# EAGLE design Solar Charge Controller (EAGLE 9.6.2)
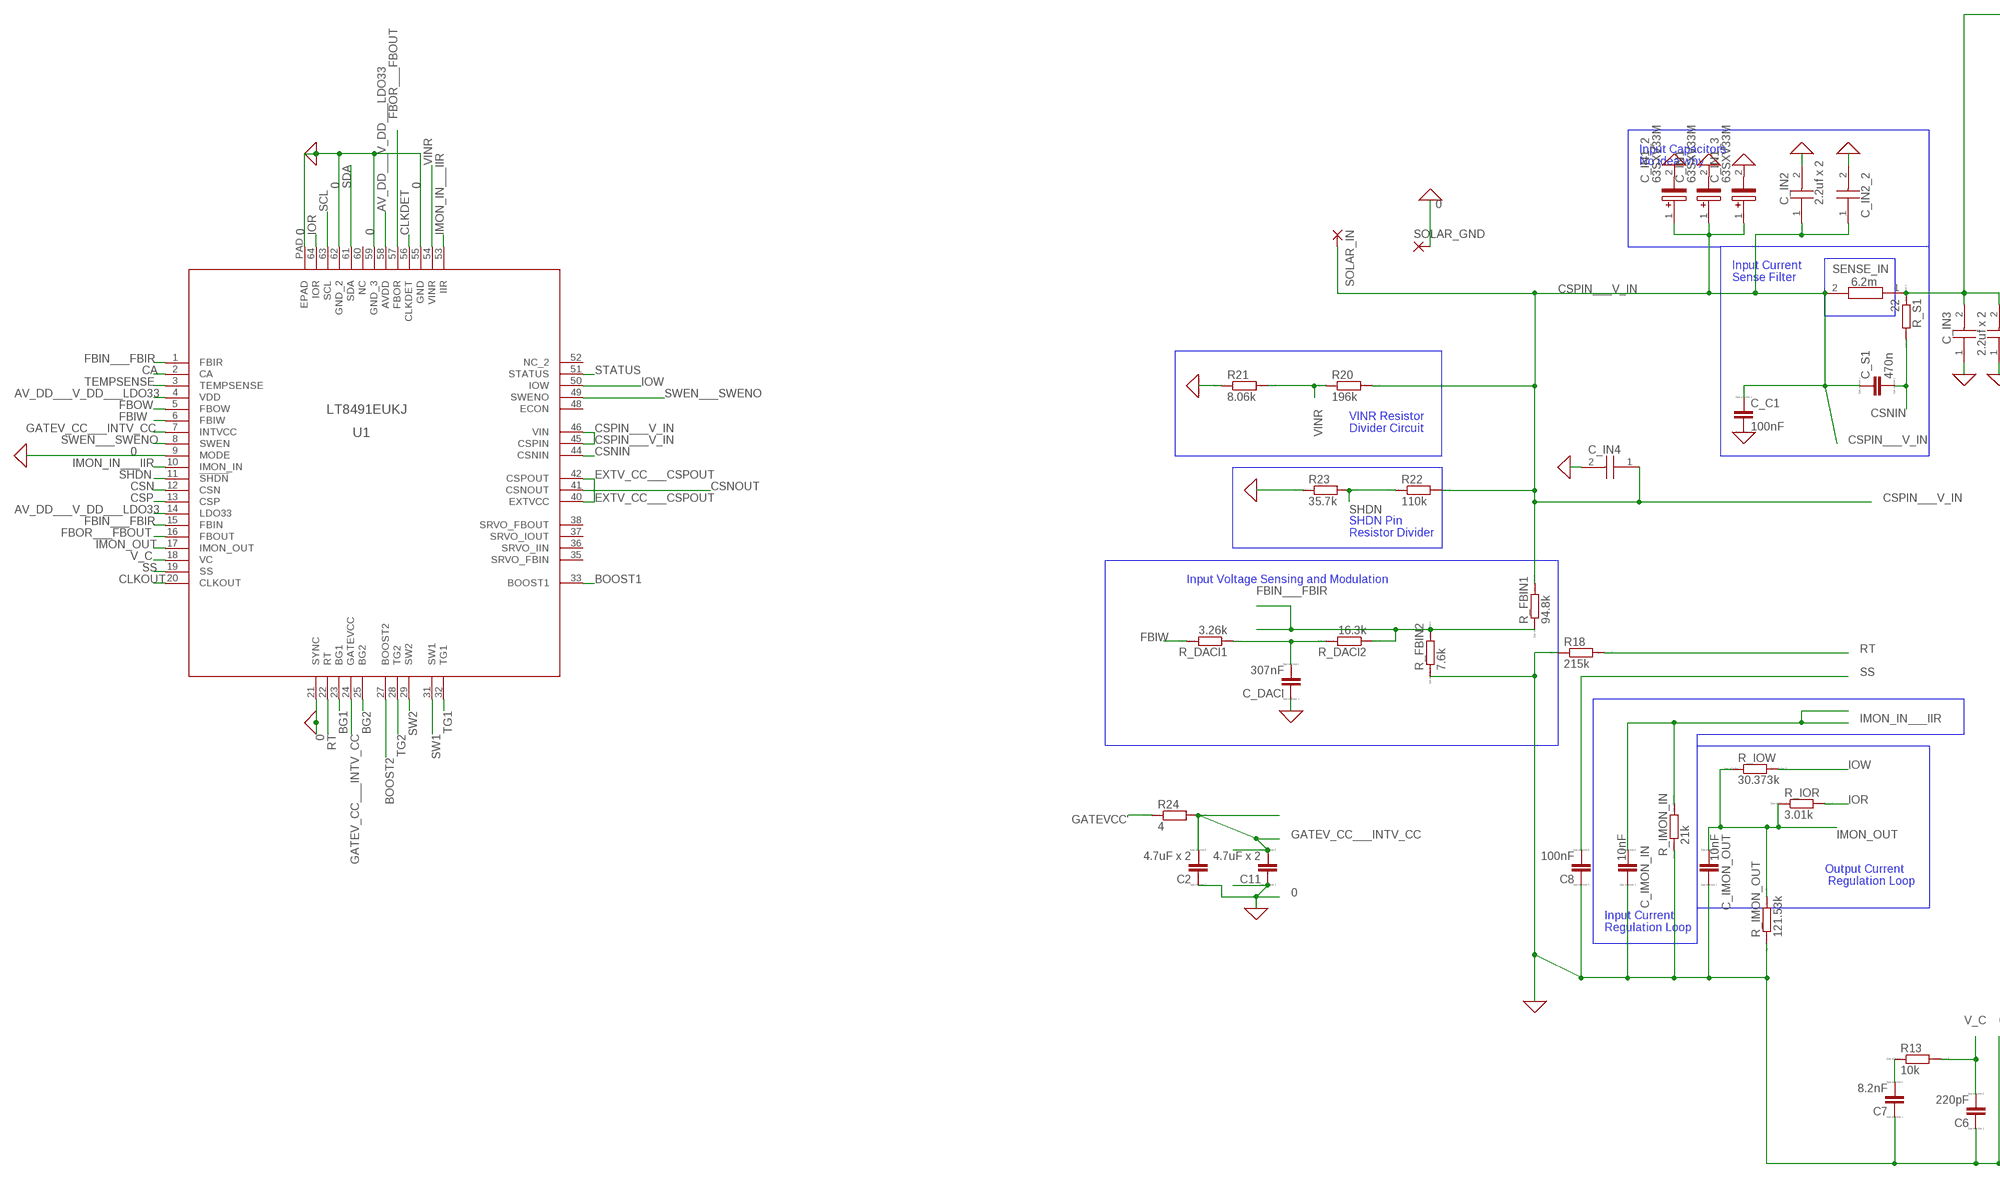
[diagram p0: schematic, sheet 1, part 1 of 2]
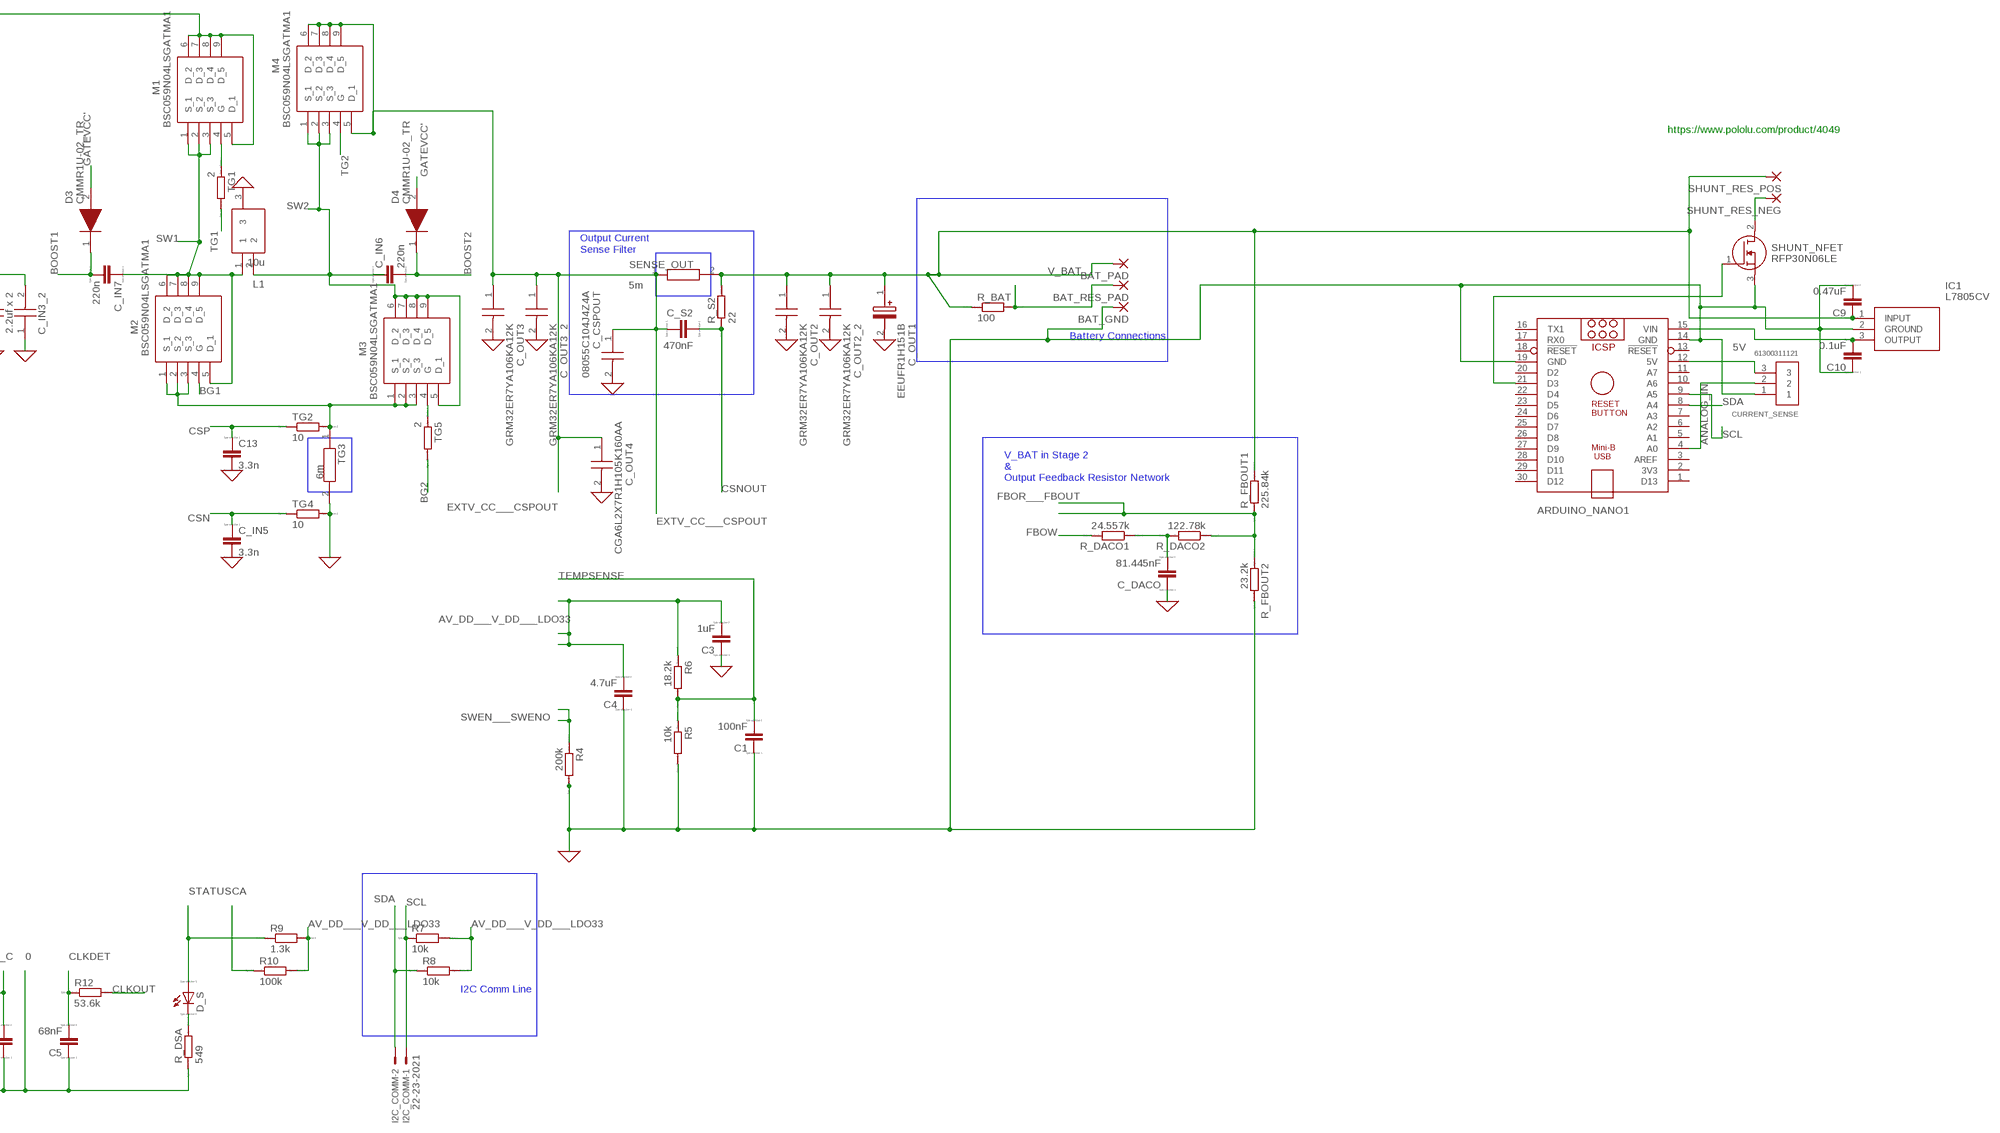
[diagram p1: schematic, sheet 1, part 2 of 2]

## Parts
ARDUINO_NANO1  ARDUINO_NANO  [ARDUINO_NANO]
BAT_GND  SMD5  [SMD2,54-5,08]
BAT_PAD  SMD5  [SMD2,54-5,08]
BAT_RES_PAD  SMD5  [SMD2,54-5,08]
C1  100nF  CC1206  [C1206]
C2  4.7uF x 2  CC1206  [C1206]
C3  1uF  CC1206  [C1206]
C4  4.7uF  CC1206  [C1206]
C5  68nF  CC0603  [C0603]
C6  220pF  CC1206  [C1206]
C7  8.2nF  CC1206  [C1206]
C8  100nF  CC1206  [C1206]
C9  0.47uF  CC1206  [C1206]
C10  0.1uF  CC1206  [C1206]
C11  4.7uF x 2  CC1206  [C1206]
C13  3.3n  CC1206  [C1206]
C_C1  100nF  CC1206  [C1206]
C_CSPOUT  08055C104J4Z4A  [CAPC2012X127N]
C_DACI  307nF  CC1206  [C1206]
C_DACO  81.445nF  CC1206  [C1206]
C_IMON_IN  10nF  CC1206  [C1206]
C_IMON_OUT  10nF  CC1206  [C1206]
C_IN1  63SXV33M  [CAPAE830X1200N]
C_IN1_2  63SXV33M  [CAPAE830X1200N]
C_IN1_3  63SXV33M  [CAPAE830X1200N]
C_IN2  2.2uf x 2  12101C225KAT2A  [CAPC3325X279N]
C_IN2_2  2.2uf x 2  12101C225KAT2A  [CAPC3325X279N]
C_IN3  2.2uf x 2  12101C225KAT2A  [CAPC3325X279N]
C_IN3_2  2.2uf x 2  12101C225KAT2A  [CAPC3325X279N]
C_IN4  2.2uf  12101C225KAT2A  [CAPC3325X279N]
C_IN5  3.3n  CC1206  [C1206]
C_IN6  220n  CC1206  [C1206]
C_IN7  220n  CC1206  [C1206]
C_OUT1  EEUFR1H151B  [CAPPRD500W65D1000H1400]
C_OUT2  GRM32ER7YA106KA12K  [CAPC3225X270N]
C_OUT2_2  GRM32ER7YA106KA12K  [CAPC3225X270N]
C_OUT3  GRM32ER7YA106KA12K  [CAPC3225X270N]
C_OUT3_2  GRM32ER7YA106KA12K  [CAPC3225X270N]
C_OUT4  CGA6L2X7R1H105K160AA  [CAPC3225X280N]
C_S1  470n  CC1206  [C1206]
C_S2  470nF  CC1206  [C1206]
CURRENT_SENSE  61300311121  [61300311121]
D3  CMMR1U-02_TR  [SODFL3818X108N]
D4  CMMR1U-02_TR  [SODFL3818X108N]
D_S  LED_E  [LED_1206]
I2C_COMM  22-23-2021  [22-23-2021]
IC1  L7805CV  [TO255P460X1020X2008-3P]
L1  10u  SER2915H-103KL  [SER2900]
M1  BSC059N04LSGATMA1  [BSC080N03LSG]
M2  BSC059N04LSGATMA1  [BSC080N03LSG]
M3  BSC059N04LSGATMA1  [BSC080N03LSG]
M4  BSC059N04LSGATMA1  [BSC080N03LSG]
R4  200k  RR1206  [R1206]
R5  10k  RR1206  [R1206]
R6  18.2k  RR1206  [R1206]
R7  10k  RR1206  [R1206]
R8  10k  RR1206  [R1206]
R9  1.3k  RR1206  [R1206]
R10  100k  RR1206  [R1206]
R12  53.6k  RR1206  [R1206]
R13  10k  RR1206  [R1206]
R18  215k  RR1206  [R1206]
R20  196k  RR1206  [R1206]
R21  8.06k  RR1206  [R1206]
R22  110k  RR1206  [R1206]
R23  35.7k  RR1206  [R1206]
R24  4  RR1206  [R1206]
R_BAT  100  RR1206  [R1206]
R_DACI1  3.26k  RR1206  [R1206]
R_DACI2  16.3k  RR1206  [R1206]
R_DACO1  24.557k  RR1206  [R1206]
R_DACO2  122.78k  RR1206  [R1206]
R_DSA  549  RR1206  [R1206]
R_FBIN1  94.8k  RR1206  [R1206]
R_FBIN2  7.6k  RR1206  [R1206]
R_FBOUT1  225.84k  RR1206  [R1206]
R_FBOUT2  23.2k  RR1206  [R1206]
R_IMON_IN  21k  RR1206  [R1206]
R_IMON_OUT  121.53k  RR1206  [R1206]
R_IOR  3.01k  RR1206  [R1206]
R_IOW  30.373k  RR1206  [R1206]
R_S1  22  RR1206  [R1206]
R_S2  22  RR1206  [R1206]
SENSE_IN  6.2m  ERJ6LWFR006V  [RESC2012X80N]
SENSE_OUT  5m  ERJ-MP2MF5M0U  [RESC3216X89N]
SHUNT_NFET  RFP30N06LE  [TO254P470X1016X2019-3P]
SHUNT_RES_NEG  SMD5  [SMD2,54-5,08]
SHUNT_RES_POS  SMD5  [SMD2,54-5,08]
SOLAR_GND  SMD5  [SMD2,54-5,08]
SOLAR_IN  SMD5  [SMD2,54-5,08]
TG1  2  RR1206  [R1206]
TG2  10  RR1206  [R1206]
TG3  6m  ERJ6LWFR006V  [RESC2012X80N]
TG4  10  RR1206  [R1206]
TG5  2  RR1206  [R1206]
U1  LT8491EUKJ  [QFN64(58)-UKJ-REV0_ADI]

## Nets
0: ARDUINO_NANO1.14(GND) ARDUINO_NANO1.19(GND) BAT_GND.1(P) C1.1 C2.1 C3.1 C4.1 C5.1 C6.1 C7.1 C8.1 C9.2 C10.1 C11.1 C13.2 C_C1.2 C_CSPOUT.2 C_DACI.1 C_DACO.1 C_IMON_IN.1 C_IMON_OUT.1 C_IN1.2(-) C_IN1_2.2(-) C_IN1_3.2(-) C_IN2.2 C_IN2_2.2 C_IN3.1 C_IN3_2.1 C_IN4.2 C_IN5.2 C_OUT1.2(-) C_OUT2.2 C_OUT2_2.2 C_OUT3.2 C_OUT3_2.2 C_OUT4.2 CURRENT_SENSE.1 IC1.2(GROUND) L1.3 R4.2 R5.2 R18.1 R21.1 R23.1 R_DSA.1 R_FBIN2.1 R_FBOUT2.2 R_IMON_IN.1 R_IMON_OUT.1 SHUNT_NFET.3(S) SOLAR_GND.1(P) TG3.2 TG4.2 U1.9(MODE) U1.21(SYNC) U1.55(GND) U1.59(GND_3) U1.62(GND_2) U1.PAD(EPAD) ; supply symbol labelled GND
5V: ARDUINO_NANO1.12(5V) CURRENT_SENSE.3
ANALOG_IN: ARDUINO_NANO1.4(A0) CURRENT_SENSE.2
AV_DD___V_DD___LDO33: C3.2 C4.2 R6.1 R7.2 R8.2 R9.2 R10.2 U1.4(VDD) U1.14(LDO33) U1.58(AVDD)
BG1: M2.4(G) U1.23(BG1)
BG2: TG5.2 U1.25(BG2)
BOOST1: C_IN7.2 D3.1(K) U1.33(BOOST1)
BOOST2: C_IN6.2 D4.1(K) U1.27(BOOST2)
CA: R10.1 U1.2(CA)
CLKDET: C5.2 R12.1 U1.56(CLKDET)
CLKOUT: R12.2 U1.20(CLKOUT)
CSN: C_IN5.1 TG4.1 U1.12(CSN)
CSNIN: C_S1.2 R_S1.2 U1.44(CSNIN)
CSNOUT: C_S2.2 R_S2.1 U1.41(CSNOUT)
CSP: C13.1 TG2.1 U1.13(CSP)
CSPIN___V_IN: C_C1.1 C_IN1.1(+) C_IN1_2.1(+) C_IN1_3.1(+) C_IN2.1 C_IN2_2.1 C_IN4.1 C_S1.1 R20.2 R22.2 R_FBIN1.2 SENSE_IN.2 SOLAR_IN.1(P) U1.45(CSPIN) U1.46(VIN)
EXTV_CC___CSPOUT: C_CSPOUT.1 C_OUT3.1 C_OUT3_2.1 C_OUT4.1 C_S2.1 M4.5(D_1) M4.6(D_2) M4.7(D_3) M4.8(D_4) M4.9(D_5) SENSE_OUT.1 U1.40(EXTVCC) U1.42(CSPOUT)
FBIN___FBIR: R_DACI2.1 R_FBIN1.1 R_FBIN2.2 U1.1(FBIR) U1.15(FBIN)
FBIW: R_DACI1.2 U1.6(FBIW)
FBOR___FBOUT: R_DACO2.1 R_FBOUT1.1 R_FBOUT2.1 U1.16(FBOUT) U1.57(FBOR)
FBOW: R_DACO1.2 U1.5(FBOW)
GATEV_CC___INTV_CC: C2.2 C11.2 R24.2 U1.7(INTVCC) U1.24(GATEVCC)
GATEVCC': D3.2(A) D4.2(A) R24.1
IMON_IN___IIR: C_IMON_IN.2 R_IMON_IN.2 U1.10(IMON_IN) U1.53(IIR)
IMON_OUT: C_IMON_OUT.2 R_IMON_OUT.2 R_IOR.1 R_IOW.1 U1.17(IMON_OUT)
IOR: R_IOR.2 U1.64(IOR)
IOW: R_IOW.2 U1.50(IOW)
N$1: C_IN3.2 C_IN3_2.2 M1.5(D_1) M1.6(D_2) M1.7(D_3) M1.8(D_4) M1.9(D_5) R_S1.1 SENSE_IN.1
N$2: M2.1(S_1) M2.2(S_2) M2.3(S_3) M3.1(S_1) M3.2(S_2) M3.3(S_3) TG2.2 TG3.1
N$3: M1.4(G) TG1.1
N$4: C_DACI.2 R_DACI1.1 R_DACI2.2
N$5: M3.4(G) TG5.1
N$6: BAT_RES_PAD.1(P) R_BAT.2
N$7: ARDUINO_NANO1.15(VIN) C10.2 IC1.3(OUTPUT)
N$8: SHUNT_NFET.2(D) SHUNT_RES_NEG.1(P)
N$9: ARDUINO_NANO1.21(D3) SHUNT_NFET.1(G)
N$23: C_DACO.2 R_DACO1.1 R_DACO2.2
N$28: D_S.C R_DSA.2
N$32: C7.2 R13.1
RT: R18.2 U1.22(RT)
SCL: ARDUINO_NANO1.9(A5) I2C_COMM.1 R7.1 U1.63(SCL)
SDA: ARDUINO_NANO1.8(A4) I2C_COMM.2 R8.1 U1.61(SDA)
SHDN: R22.1 R23.2 U1.11(!SHDN)
SS: C8.2 U1.19(SS)
STATUS: D_S.A R9.1 U1.51(STATUS)
SW1: C_IN7.1 L1.1 M1.1(S_1) M1.2(S_2) M1.3(S_3) M2.5(D_1) M2.6(D_2) M2.7(D_3) M2.8(D_4) M2.9(D_5) U1.31(SW1)
SW2: C_IN6.1 L1.2 M3.5(D_1) M3.6(D_2) M3.7(D_3) M3.8(D_4) M3.9(D_5) M4.1(S_1) M4.2(S_2) M4.3(S_3) U1.29(SW2)
SWEN___SWENO: R4.1 U1.8(SWEN) U1.49(SWENO)
TEMPSENSE: C1.2 R5.1 R6.2 U1.3(TEMPSENSE)
TG1: TG1.2 U1.32(TG1)
TG2: M4.4(G) U1.28(TG2)
V_BAT: BAT_PAD.1(P) C9.1 C_OUT1.1(+) C_OUT2.1 C_OUT2_2.1 IC1.1(INPUT) R_BAT.1 R_FBOUT1.2 R_S2.2 SENSE_OUT.2 SHUNT_RES_POS.1(P)
V_C: C6.2 R13.2 U1.18(VC)
VINR: R20.1 R21.2 U1.54(VINR)
Unconnected: ARDUINO_NANO1.1(D13) ARDUINO_NANO1.2(3V3) ARDUINO_NANO1.3(AREF) ARDUINO_NANO1.5(A1) ARDUINO_NANO1.6(A2) ARDUINO_NANO1.7(A3) ARDUINO_NANO1.10(A6) ARDUINO_NANO1.11(A7) ARDUINO_NANO1.13(!RESET) ARDUINO_NANO1.16(TX1) ARDUINO_NANO1.17(RX0) ARDUINO_NANO1.18(!RESET) ARDUINO_NANO1.20(D2) ARDUINO_NANO1.22(D4) ARDUINO_NANO1.23(D5) ARDUINO_NANO1.24(D6) ARDUINO_NANO1.25(D7) ARDUINO_NANO1.26(D8) ARDUINO_NANO1.27(D9) ARDUINO_NANO1.28(D10) ARDUINO_NANO1.29(D11) ARDUINO_NANO1.30(D12) U1.35(SRVO_FBIN) U1.36(SRVO_IIN) U1.37(SRVO_IOUT) U1.38(SRVO_FBOUT) U1.48(ECON) U1.52(NC_2) U1.60(NC)

## Notes on the sheet
- https://www.pololu.com/product/4049
- Input Capacitors
  No idea why
- Output Current
  Sense Filter
- Input Current
  Sense Filter
- Battery Connections
- VINR Resistor
  Divider Circuit
- V_BAT in Stage 2
  &
  Output Feedback Resistor Network
- SHDN Pin
  Resistor Divider
- Input Voltage Sensing and Modulation
- Output Current
   Regulation Loop
- Input Current
  Regulation Loop
- I2C Comm Line

## Library data of the parts
ARDUINO_NANO1 = ArduinoNanoV30:ARDUINO_NANO: Arduino Nano V3.0 Overview: The Arduino Nano is a small, complete, and breadboard-friendly board based on the ATmega328 (Arduino Nano 3.x) or ATmega168 (Arduino Nano 2.x). It has more or less the same functionality of the Arduino Duemilanove, but in a different package. It lacks only a DC power jack, and works with a Mini-B USB cable instead of a standard one. The Nano was designed and is being produced by Gravitech. Specifications: Microcontroller Atmel ATmega168 or ATmega328 Operating Voltage (logic level) 5 V Input Voltage (recommended) 7-12 V Input Voltage (limits) 6-20 V Digital I/O Pins 14 (of which 6 provide PWM output) Analog Input Pins 8 DC Current per I/O Pin 40 mA Flash Memory 16 KB (ATmega168) or 32 KB (ATmega328) of which 2 KB used by bootloader SRAM 1 KB (ATmega168) or 2 KB (ATmega328) EEPROM 512 bytes (ATmega168) or 1 KB (ATmega328) Clock Speed 16 MHz Dimensions 0.73" x 1.70" Length 45 mm Width 18 mm Weigth 5 g Power: The Arduino Nano can be powered via the Mini-B USB connection, 6-20V unregulated external power supply (pin 30), or 5V regulated external power supply (pin 27). The power source is automatically selected to the highest voltage source. Memory: The ATmega168 has 16 KB of flash memory for storing code (of which 2 KB is used for the bootloader); the ATmega328 has 32 KB, (also with 2 KB used for the bootloader). The ATmega168 has 1 KB of SRAM and 512 bytes of EEPROM (which can be read and written with the EEPROM library); the ATmega328 has 2 KB of SRAM and 1 KB of EEPROM. Input and Output: Each of the 14 digital pins on the Nano can be used as an input or output, using pinMode(), digitalWrite(), and digitalRead() functions. They operate at 5 volts. Each pin can provide or receive a maximum of 40 mA and has an internal pull-up resistor (disconnected by default) of 20-50 kOhms. In addition, some pins have specialized functions. Visit Arduino - ArduinoBoardNano <https://www.arduino.cc/en/Main/ArduinoBoardNano>
BAT_GND BAT_PAD BAT_RES_PAD SHUNT_RES_NEG SHUNT_RES_POS SOLAR_GND SOLAR_IN = wirepad:SMD5: SMD PAD
C1-C11 C13 C_C1 C_DACI C_DACO C_IMON_IN C_IMON_OUT C_IN5-C_IN7 C_S1 C_S2 = eagle-ltspice:C: CAPACITOR, European symbol; SPICEMODEL: NONE; SPICEPREFIX: C
C_CSPOUT = 08055C104J4Z4A:08055C104J4Z4A: Cap Ceramic 0.1uF 50V X7R 5% SMD 0805 FlexiTerm 125C Paper T/R Source: Datasheet <http://catalogs.avx.com/SurfaceMount.pdf>; ARROW_PART_NUMBER: 08055C104J4Z4A; ARROW_PRICE-STOCK: https://www.arrow.com/en/products/08055c104j4z4a/avx; DESCRIPTION: Cap Ceramic 0.1uF 50V X7R 5% SMD 0805 FlexiTerm 125C Paper T/R; HEIGHT: 1.27mm; MANUFACTURER_NAME: AVX; MANUFACTURER_PART_NUMBER: 08055C104J4Z4A; MOUSER_PART_NUMBER: 581-08055C104J4Z4A; MOUSER_PRICE-STOCK: https://www.mouser.co.uk/ProductDetail/AVX/08055C104J4Z4A?qs=xMTsDkQFXIw7L45hGtT%2Fjg%3D%3D
C_IN1 C_IN1_2 C_IN1_3 = 63SXV33M:63SXV33M: PANASONIC ELECTRONIC COMPONENTS - 63SXV33M - CAP, ALU POLYMER, 33UF, 63V, RAD CAN Source: Datasheet <https://industrial.panasonic.com/cdbs/www-data/pdf/AAB8000/AAB8000C259.pdf>; ARROW_PART_NUMBER: 63SXV33M; ARROW_PRICE-STOCK: https://www.arrow.com/en/products/63sxv33m/panasonic; DESCRIPTION: PANASONIC ELECTRONIC COMPONENTS - 63SXV33M - CAP, ALU POLYMER, 33UF, 63V, RAD CAN; HEIGHT: 12mm; MANUFACTURER_NAME: Panasonic; MANUFACTURER_PART_NUMBER: 63SXV33M; MOUSER_PART_NUMBER: 667-63SXV33M; MOUSER_PRICE-STOCK: https://www.mouser.co.uk/ProductDetail/Panasonic/63SXV33M?qs=LkACrQhHtvC3OEKZ9h0MUg%3D%3D
C_IN2 C_IN2_2 C_IN3 C_IN3_2 C_IN4 = 12101C225KAT2A:12101C225KAT2A: AVX 1210 Standard 2.2 Source: Datasheet <http://datasheets.avx.com/X7RDielectric.pdf>; ARROW_PART_NUMBER: 12101C225KAT2A; ARROW_PRICE-STOCK: https://www.arrow.com/en/products/12101c225kat2a/avx; DESCRIPTION: AVX 1210 Standard 2.2; HEIGHT: 2.79mm; MANUFACTURER_NAME: AVX; MANUFACTURER_PART_NUMBER: 12101C225KAT2A; MOUSER_PART_NUMBER: 581-12101C225KAT2A; MOUSER_PRICE-STOCK: https://www.mouser.co.uk/ProductDetail/AVX/12101C225KAT2A?qs=sEn5VCT5Piadpj%252BmhssWtA%3D%3D
C_OUT1 = EEUFR1H151B:EEUFR1H151B: Cap Aluminum Lytic 150uF 50V 20% (10 X 12.5mm) Radial 5mm 1170mA 6000h 105C Ammo Source: Datasheet <https://www.mouser.com/datasheet/2/315/ABA0000C1022-1144690.pdf>; DESCRIPTION: Cap Aluminum Lytic 150uF 50V 20% (10 X 12.5mm) Radial 5mm 1170mA 6000h 105C Ammo; HEIGHT: 14mm; MANUFACTURER_NAME: Panasonic; MANUFACTURER_PART_NUMBER: EEUFR1H151B
C_OUT2 C_OUT2_2 C_OUT3 C_OUT3_2 = GRM32ER7YA106KA12K:GRM32ER7YA106KA12K: Multilayer Ceramic Capacitors MLCC - SMD/SMT Source: Datasheet <http://psearch.en.murata.com/capacitor/product/GRM32ER71E226KE15#.pdf>; ARROW_PART_NUMBER: GRM32ER7YA106KA12K; ARROW_PRICE-STOCK: https://www.arrow.com/en/products/grm32er7ya106ka12k/murata-manufacturing; DESCRIPTION: Multilayer Ceramic Capacitors MLCC - SMD/SMT; HEIGHT: 2.7mm; MANUFACTURER_NAME: Murata Electronics; MANUFACTURER_PART_NUMBER: GRM32ER7YA106KA12K; MOUSER_PART_NUMBER: 81-GRM32ER7YA106KA2K; MOUSER_PRICE-STOCK: https://www.mouser.com/Search/Refine.aspx?Keyword=81-GRM32ER7YA106KA2K
C_OUT4 = CGA6L2X7R1H105K160AA:CGA6L2X7R1H105K160AA: TDK CGA6L2X7R1H105K160AA 1F MLCC 50V dc +/-10% Tolerance SMD Source: Datasheet <https://www.mouser.com/datasheet/2/400/lcc_automotive_general_en-843974.pdf>; ARROW_PART_NUMBER: CGA6L2X7R1H105K160AA; ARROW_PRICE-STOCK: https://www.arrow.com/en/products/cga6l2x7r1h105k160aa/tdk; DESCRIPTION: TDK CGA6L2X7R1H105K160AA 1F MLCC 50V dc +/-10% Tolerance SMD; HEIGHT: 2.8mm; MANUFACTURER_NAME: TDK; MANUFACTURER_PART_NUMBER: CGA6L2X7R1H105K160AA; MOUSER_PART_NUMBER: 810-CGA6L2X7R1H105K; MOUSER_PRICE-STOCK: https://www.mouser.com/Search/Refine.aspx?Keyword=810-CGA6L2X7R1H105K
CURRENT_SENSE = Headers:61300311121: CONN HEADER VERT 3POS 2.54MM Manufacturer's datasheet <https://katalog.we-online.de/em/datasheet/6130xx11121.pdf>; CREATED_BY: PCBLayout.com; DIGI_KEY_PART_NUMBER: 732-5316-ND; MANUFACTURER: Wurth Electronics Inc.; MPN: 61300311121
D3 D4 = CMMR1U-02_TR:CMMR1U-02_TR: Rectifiers Ultra Fast Rectifier Single Source: Datasheet <https://www.centralsemi.com/get_document.php?cmp=1&mergetype=pd&mergepath=pd&pdf_id=CMMR1U_SERIES.PDF>; DESCRIPTION: Rectifiers Ultra Fast Rectifier Single; HEIGHT: 1.08mm; MANUFACTURER_NAME: Central Semiconductor; MANUFACTURER_PART_NUMBER: CMMR1U-02 TR; MOUSER_PART_NUMBER: 610-CMMR1U-02; MOUSER_PRICE-STOCK: https://www.mouser.com/Search/Refine.aspx?Keyword=610-CMMR1U-02
D_S = eagle-ltspice:LED_E: LED Source: http://www.osram.convergy.de Source: www.luxeon.com Source: www.kingbright.com; SPICEMODEL: NONE; SPICEPREFIX: D; SPICETYPE: diode
I2C_COMM = con-molex:22-23-2021: .100" (2.54mm) Center Header - 2 Pin; MF: MOLEX; MPN: 22-23-2021; OC_FARNELL: 1462926; OC_NEWARK: 25C3832
IC1 = L7805CV:L7805CV: Linear voltage regulator,L7805CV 5V 1.5A STMicroelectronics L7805CV, Single Linear Voltage Regulator, 1.5A 5 V, 3-Pin TO-220 Source: Datasheet <http://www.st.com/web/en/resource/technical/document/datasheet/CD00000444.pdf>; ARROW_PART_NUMBER: L7805CV; ARROW_PRICE-STOCK: https://www.arrow.com/en/products/l7805cv/stmicroelectronics; DESCRIPTION: Linear voltage regulator,L7805CV 5V 1.5A STMicroelectronics L7805CV, Single Linear Voltage Regulator, 1.5A 5 V, 3-Pin TO-220; HEIGHT: 4.6mm; MANUFACTURER_NAME: STMicroelectronics; MANUFACTURER_PART_NUMBER: L7805CV; MOUSER_PART_NUMBER: 511-L7805CV; MOUSER_PRICE-STOCK: https://www.mouser.co.uk/ProductDetail/STMicroelectronics/L7805CV/?qs=9NrABl3fj%2FqplZAHiYUxWg%3D%3D
L1 = SER2915H-103KL:SER2915H-103KL: Fixed Inductors SER2915H Hi Current 10 uH 10 % 30 A Source: Datasheet <http://www.coilcraft.com/pdfs/ser2900.pdf>; DESCRIPTION: Fixed Inductors SER2915H Hi Current 10 uH 10 % 30 A; HEIGHT: mm; MANUFACTURER_NAME: COILCRAFT; MANUFACTURER_PART_NUMBER: SER2915H-103KL; MOUSER_PART_NUMBER: 994-SER2915H-103KL; MOUSER_PRICE-STOCK: https://www.mouser.co.uk/ProductDetail/Coilcraft/SER2915H-103KL?qs=zCSbvcPd3pbm6JOcdM0KSg%3D%3D
M1-M4 = BSC059N04LSGATMA1:BSC059N04LSGATMA1: MOSFET N-Ch 40V 73A TDSON-8 OptiMOS 3 Source: Datasheet <https://www.infineon.com/dgdl/BSC059N04LSG_rev1.02.pdf?folderId=db3a3043156fd5730115c7d50620107c&fileId=db3a30431689f4420116c4481e4b081f>; ARROW_PART_NUMBER: BSC059N04LSGATMA1; ARROW_PRICE-STOCK: https://www.arrow.com/en/products/bsc059n04lsgatma1/infineon-technologies-ag; DESCRIPTION: MOSFET N-Ch 40V 73A TDSON-8 OptiMOS 3; HEIGHT: mm; MANUFACTURER_NAME: Infineon; MANUFACTURER_PART_NUMBER: BSC059N04LSGATMA1; MOUSER_PART_NUMBER: 726-BSC059N04LSGATMA; MOUSER_PRICE-STOCK: https://www.mouser.co.uk/ProductDetail/Infineon-Technologies/BSC059N04LSGATMA1/?qs=OwbwYO03UsIeXsXqrPLFnQ%3D%3D
R4-R10 R12 R13 R18 R20-R24 R_BAT R_DACI1 R_DACI2 R_DACO1 R_DACO2 R_DSA R_FBIN1 R_FBIN2 R_FBOUT1 R_FBOUT2 R_IMON_IN R_IMON_OUT R_IOR R_IOW R_S1 R_S2 TG1 TG2 TG4 TG5 = eagle-ltspice:R: RESISTOR, European symbol; SPICEMODEL: NONE; SPICEPREFIX: R
SENSE_IN TG3 = ERJ6LWFR006V:ERJ6LWFR006V: Res Current Sense Thick Film 0805 0.006 Ohm 1% 1/2W 0ppm/C to 300ppm/C Molded Paper T/R - Tape and Reel Source: Datasheet <https://4donline.ihs.com/images/VipMasterIC/IC/PANA/PANA-S-A0009017013/PANA-S-A0009017013-1.pdf?hkey=EF798316E3902B6ED9A73243A3159BB0>; DESCRIPTION: Res Current Sense Thick Film 0805 0.006 Ohm 1% 1/2W 0ppm/C to 300ppm/C Molded Paper T/R - Tape and Reel; HEIGHT: 0.8mm; MANUFACTURER_NAME: Panasonic; MANUFACTURER_PART_NUMBER: ERJ6LWFR006V
SENSE_OUT = ERJ-MP2MF5M0U:ERJ-MP2MF5M0U: Panasonic ERJMP2 Series Metal Plate Current Sensing Surface Mount Resistor 1206 Case 5m +/-1% 1W +/-75ppm/C Source: Datasheet <https://industrial.panasonic.com/cdbs/www-data/pdf/RDN0000/AOA0000C316.pdf>; DESCRIPTION: Panasonic ERJMP2 Series Metal Plate Current Sensing Surface Mount Resistor 1206 Case 5m +/-1% 1W +/-75ppm/C; HEIGHT: 0.89mm; MANUFACTURER_NAME: Panasonic; MANUFACTURER_PART_NUMBER: ERJ-MP2MF5M0U; MOUSER_PART_NUMBER: 667-ERJ-MP2MF5M0U; MOUSER_PRICE-STOCK: https://www.mouser.com/Search/Refine.aspx?Keyword=667-ERJ-MP2MF5M0U
SHUNT_NFET = RFP30N06LE:RFP30N06LE: MOSFET TO-220AB N-Ch Power Source: Datasheet <https://media.digikey.com/pdf/Data Sheets/Fairchild PDFs/RFP30N06LE_RF1S30N06LESM.pdf>; DESCRIPTION: MOSFET TO-220AB N-Ch Power; HEIGHT: 4.7mm; MANUFACTURER_NAME: ON Semiconductor; MANUFACTURER_PART_NUMBER: RFP30N06LE; MOUSER_PART_NUMBER: 512-RFP30N06LE; MOUSER_PRICE-STOCK: https://www.mouser.co.uk/ProductDetail/ON-Semiconductor-Fairchild/RFP30N06LE?qs=mdiO5HdF0KgGbixxeJqneA%3D%3D
U1 = LT8491:LT8491EUKJ; BUILT_BY: SunStream; COPYRIGHT: Copyright (C) 2018 Accelerated Designs. All rights reserved; MANUFACTURER_PART_NUMBER: LT8491EUKJ; SOURCELIBRARY: Analog_Devices_Inc_2020-09-15; VENDOR: Analog Devices Inc

## Net classes
0 default: clearance 0.205 mm

## Board
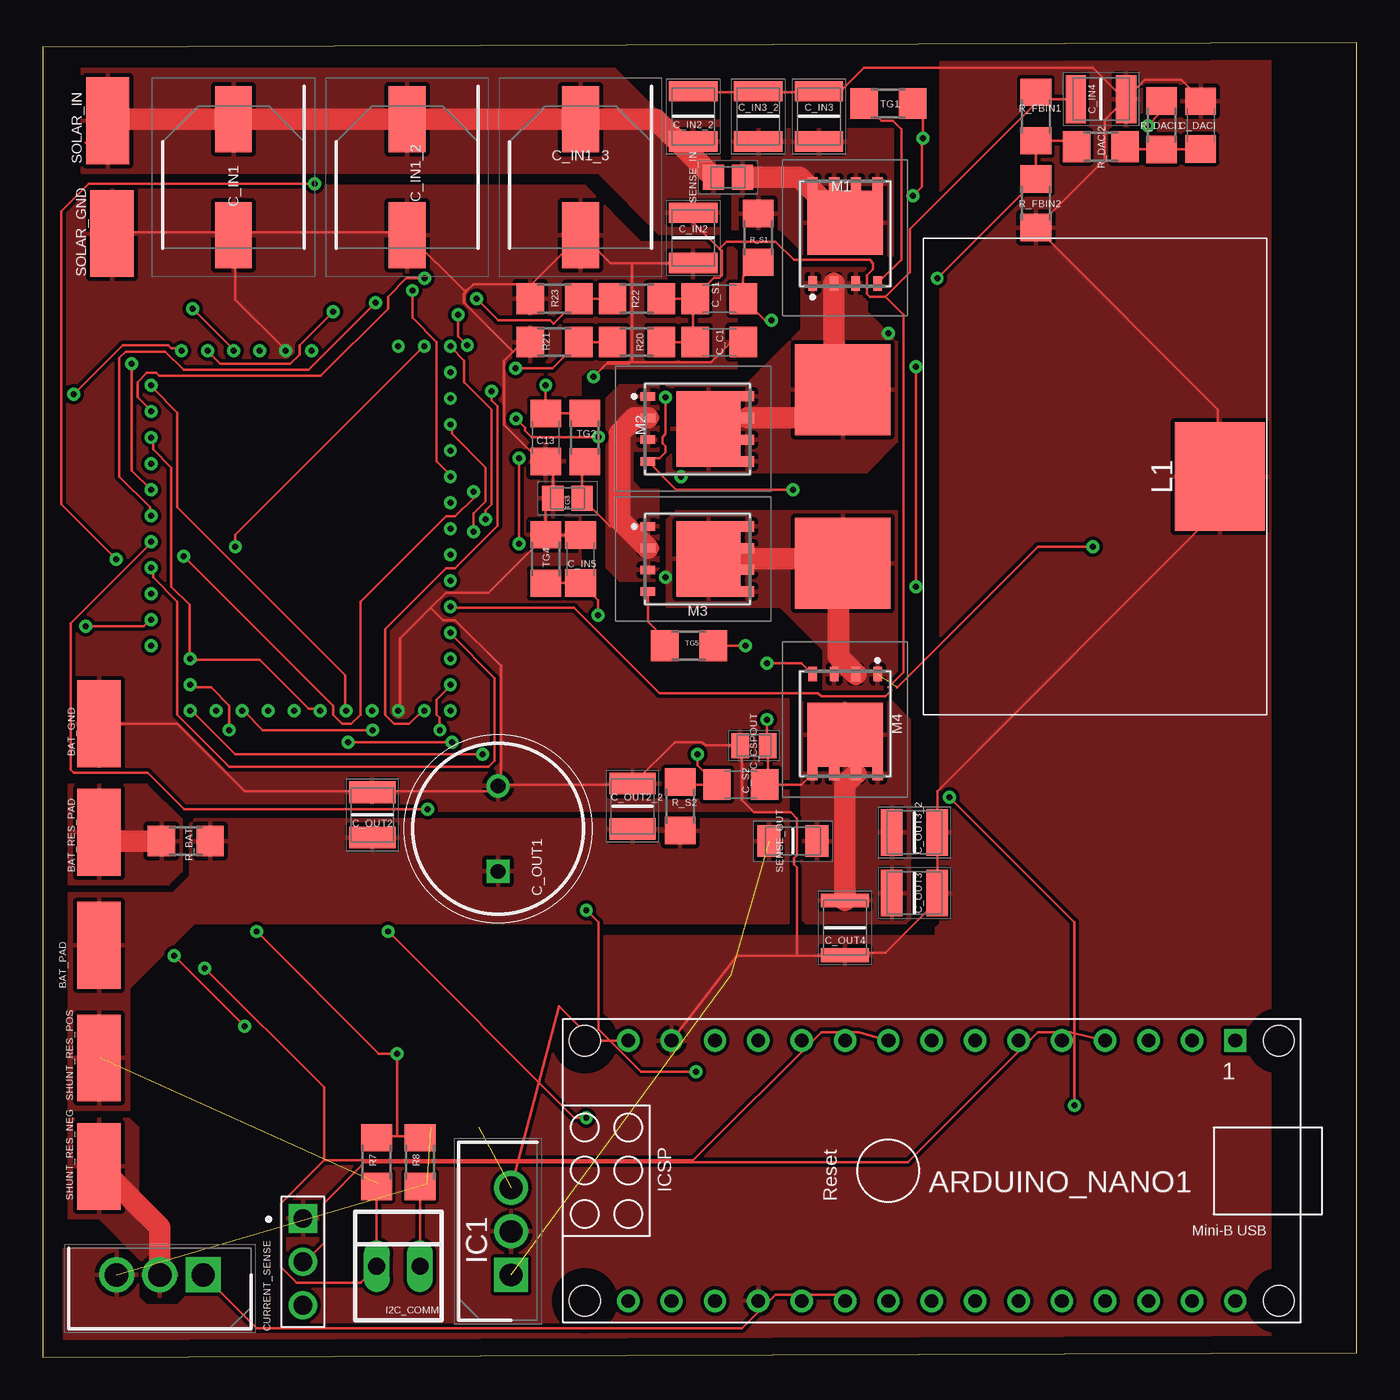
[diagram p2: board, top side]
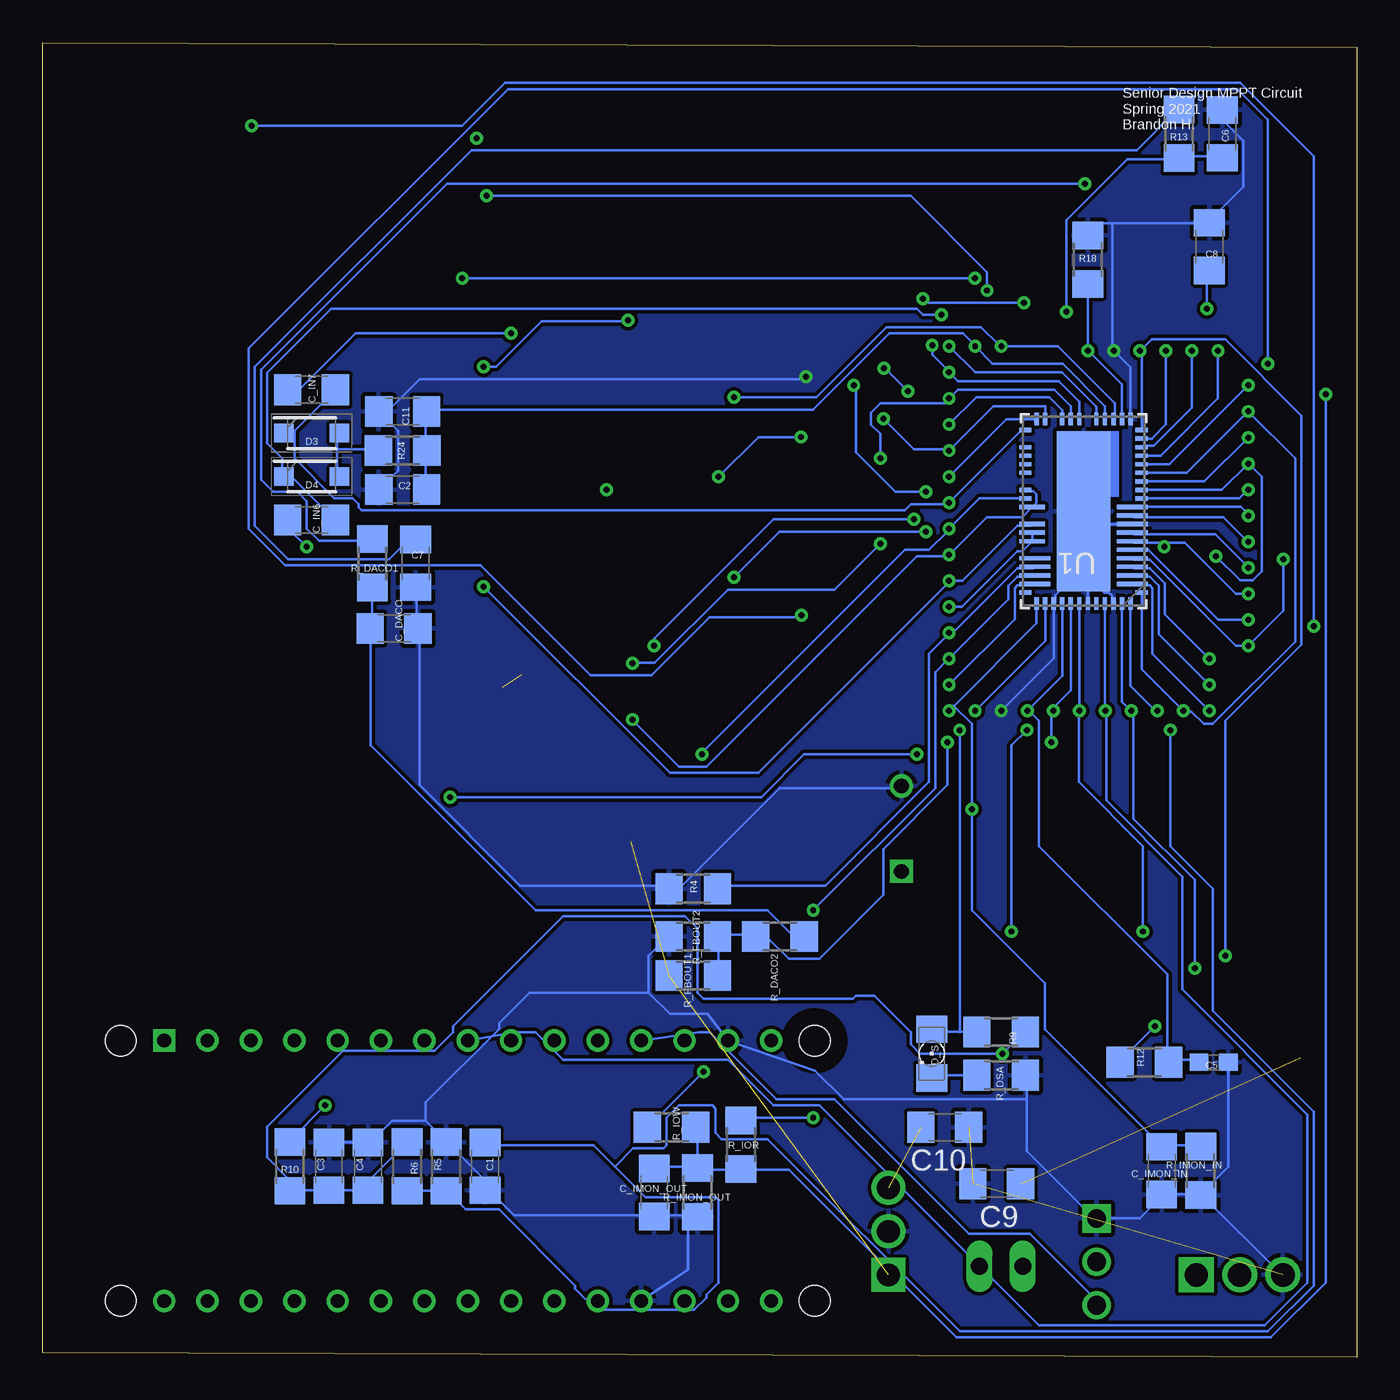
[diagram p3: board, bottom side, seen from below]

Size 76.96 x 76.96 mm. Coordinates in mm from the lower left corner, seen from the top.
Outline: 0,0 76.96,0.25 76.96,76.96 0,76.71 0,0
Copper layers (1*16): Top 0.035mm / dielectric 1.5mm / Bottom 0.035mm
Design rules "default": minimum track width 6mil, minimum drill 0.35mm, track to track 6mil, track to pad 6mil, pad to pad 6mil, via to via 6mil, smd to smd 6mil, copper to edge 40mil, drill to drill 6mil, minimum pad ring 10mil, minimum via ring 8mil, stop-mask expansion 4mil, vias tented up to drill 0mil, thermal gap 10mil

### Footprints (pad centres in the part's own frame; a part is rotated, then mirrored left to right if it is on the bottom)
ARDUINO_NANO = drill 0.8 square: 1 -20.32,-7.62 | drill 0.8: 2 -17.78,-7.62; 3 -15.24,-7.62; 4 -12.7,-7.62; 5 -10.16,-7.62; 6 -7.62,-7.62; 7 -5.08,-7.62; 8 -2.54,-7.62; 9 0,-7.62; 10 2.54,-7.62; 11 5.08,-7.62; 12 7.62,-7.62; 13 10.16,-7.62; 14 12.7,-7.62; 15 15.24,-7.62; 16 15.24,7.62; 17 12.7,7.62; 18 10.16,7.62; 19 7.62,7.62; 20 5.08,7.62; 21 2.54,7.62; 22 0,7.62; 23 -2.54,7.62; 24 -5.08,7.62; 25 -7.62,7.62; 26 -10.16,7.62; 27 -12.7,7.62; 28 -15.24,7.62; 29 -17.78,7.62; 30 -20.32,7.62 | hole 1.778: -22.86,-7.62; -22.86,7.62; 17.78,7.62; 17.78,-7.62
SMD2,54-5,08 = smd 2.54 x 5.08: 1 0,0
C1206 = smd 1.6 x 1.8: 1 -1.4,0; 2 1.4,0
C0603 = smd 1.1 x 1: 1 -0.85,0; 2 0.85,0
CAPC2012X127N = smd 1.02 x 1.47: 1 -0.81,0; 2 0.81,0
CAPAE830X1200N = smd 3.85 x 2.15: 1 -3.4,0; 2 3.4,0
CAPC3325X279N = smd 1.18 x 2.82: 1 -1.47,0; 2 1.47,0
CAPPRD500W65D1000H1400 = drill 0.85 pad 1.275 square: 1 0,0 | drill 0.85 pad 1.275: 2 5,0
CAPC3225X270N = smd 1.26 x 2.72: 1 -1.33,0; 2 1.33,0
CAPC3225X280N = smd 0.81 x 2.82: 1 -1.6,0; 2 1.6,0
61300311121 = drill 1.1 square: 1 -2.54,0 | drill 1.1: 2 0,0; 3 2.54,0
SODFL3818X108N = smd 1.12 x 1.08: 1 -1.625,0; 2 1.625,0
LED_1206 = smd 1.6 x 1.803: A -1.422,0; C 1.422,0
22-23-2021 = drill 1 long: 1 -1.27,0; 2 1.27,0
TO255P460X1020X2008-3P = drill 1.32 pad 1.98 square: 1 0,0 | drill 1.32 pad 1.98: 2 2.55,0; 3 5.1,0
SER2900 = smd 5.33 x 5.59: 1 -5.075,-14.355; 2 5.075,-14.355 | smd 6.35 x 5.28: 3 0,7.72
BSC080N03LSG = smd 0.5 x 0.85: 1 -1.905,-2.662; 2 -0.635,-2.662; 3 0.635,-2.662; 4 1.905,-2.662 | smd 0.6 x 0.8: 5 1.905,3.163; 6 0.635,3.163; 7 -0.635,3.163; 8 -1.905,3.163 | smd 4.41 x 3.75: 9 0,0.888
R1206 = smd 1.6 x 1.803: 1 -1.422,0; 2 1.422,0
RESC2012X80N = smd 1.25 x 1.45: 1 -0.85,0; 2 0.85,0
RESC3216X89N = smd 1.35 x 1.85: 1 -1.4,0; 2 1.4,0
TO254P470X1016X2019-3P = drill 1.37 pad 2.055 square: 1 0,0 | drill 1.37 pad 2.055: 2 2.535,0; 3 5.07,0
QFN64(58)-UKJ-REV0_ADI = smd 0.711 x 0.254: 1 -3.4,4.751; 12 -3.4,-0.75; 13 -3.4,-1.25; 14 -3.4,-1.75; 15 -3.4,-2.251; 16 -3.4,-2.751; 17 -3.4,-3.251; 18 -3.4,-3.751; 19 -3.4,-4.251; 20 -3.4,-4.751; 33 3.4,-4.751; 35 3.4,-3.751; 36 3.4,-3.251; 37 3.4,-2.751; 38 3.4,-2.251; 40 3.4,-1.25; 41 3.4,-0.75; 52 3.4,4.751 | smd 1.803 x 0.254: 2 -2.854,4.251; 3 -2.854,3.751; 4 -2.854,3.251; 5 -2.854,2.751; 6 -2.854,2.251; 7 -2.854,1.75; 8 -2.854,1.25; 9 -2.854,0.75; 10 -2.854,0.25; 11 -2.854,-0.25; 48 2.854,2.751; 49 2.854,3.251; 50 2.854,3.751; 51 2.854,4.251 | smd 0.254 x 0.711: 21 -2.751,-5.4; 22 -2.251,-5.4; 23 -1.75,-5.4; 24 -1.25,-5.4; 25 -0.75,-5.4; 27 0.25,-5.4; 28 0.75,-5.4; 29 1.25,-5.4; 31 2.251,-5.4; 32 2.751,-5.4; 53 2.751,5.4; 54 2.251,5.4; 55 1.75,5.4; 56 1.25,5.4; 57 0.75,5.4; 58 0.25,5.4; 59 -0.25,5.4; 60 -0.75,5.4; 61 -1.25,5.4; 62 -1.75,5.4; 63 -2.251,5.4; 64 -2.751,5.4 | smd 1.499 x 0.254: 42 3.006,-0.25; 44 3.006,0.75; 45 3.006,1.25; 46 3.006,1.75 | smd 3.15 x 9.373: PAD 0,0

### Placement (x,y rotation side)
ARDUINO_NANO1  49.53,10.92 180 top
BAT_GND  3.3,37.08 180 top
BAT_PAD  3.3,24.13 180 top
BAT_RES_PAD  3.3,30.73 180 top
C1  51.05,11.18 90 bottom
C2  55.88,50.8 0 bottom
C3  60.2,11.18 270 bottom
C4  57.91,11.18 270 bottom
C5  8.38,17.27 180 bottom
C6  7.87,71.63 270 bottom
C7  55.12,46.48 90 bottom
C8  8.64,65.02 270 bottom
C9  21.08,10.16 180 bottom
C10  24.13,13.46 180 bottom
C11  55.88,55.37 0 bottom
C13  29.46,53.85 270 top
C_C1  39.62,59.44 0 top
C_CSPOUT  41.66,35.81 180 top
C_DACI  67.82,72.14 270 top
C_DACO  56.39,42.67 180 bottom
C_IMON_IN  11.43,10.92 90 bottom
C_IMON_OUT  41.15,9.65 90 bottom
C_IN1  11.18,69.09 270 top
C_IN1_2  21.34,69.09 270 top
C_IN1_3  31.5,69.09 270 top
C_IN2  38.1,65.53 270 top
C_IN2_2  38.1,72.64 90 top
C_IN3  45.47,72.64 270 top
C_IN3_2  41.91,72.64 270 top
C_IN4  61.98,73.66 0 top
C_IN5  31.5,46.74 90 top
C_IN6  61.21,49.02 0 bottom
C_IN7  61.21,56.64 0 bottom
C_OUT1  26.67,28.45 90 top
C_OUT2  19.3,31.75 90 top
C_OUT2_2  34.54,32.26 90 top
C_OUT3  51.05,27.18 0 top
C_OUT3_2  51.05,30.73 0 top
C_OUT4  46.99,25.15 270 top
C_S1  39.62,61.98 0 top
C_S2  40.89,33.53 180 top
CURRENT_SENSE  15.24,5.59 270 top
D3  61.21,54.1 0 bottom
D4  61.21,51.56 0 bottom
D_S  24.89,17.78 270 bottom
I2C_COMM  20.83,5.33 0 top
IC1  27.43,4.83 90 top
L1  61.21,51.56 270 top
M1  46.99,65.53 0 top
M2  38.1,54.36 270 top
M3  38.1,46.74 270 top
M4  46.99,37.34 180 top
R4  38.86,27.43 180 bottom
R5  53.34,11.18 90 bottom
R6  55.63,11.18 270 bottom
R7  19.56,11.43 90 top
R8  22.1,11.43 90 top
R9  20.83,19.05 0 bottom
R10  62.48,11.18 270 bottom
R12  12.45,17.27 180 bottom
R13  10.41,71.63 270 bottom
R18  15.75,64.26 270 bottom
R20  34.8,59.44 0 top
R21  29.97,59.44 0 top
R22  34.8,61.98 0 top
R23  29.97,61.98 0 top
R24  55.88,53.09 0 bottom
R_BAT  8.38,30.23 180 top
R_DACI1  65.53,72.14 90 top
R_DACI2  61.98,70.87 0 top
R_DACO1  57.66,46.48 90 bottom
R_DACO2  33.78,24.64 0 bottom
R_DSA  20.83,16.51 180 bottom
R_FBIN1  58.17,72.64 90 top
R_FBIN2  58.17,67.56 90 top
R_FBOUT1  38.86,22.35 180 bottom
R_FBOUT2  38.86,24.64 180 bottom
R_IMON_IN  9.14,10.92 90 bottom
R_IMON_OUT  38.61,9.65 90 bottom
R_IOR  36.07,12.45 90 bottom
R_IOW  40.13,13.46 180 bottom
R_S1  41.91,65.53 270 top
R_S2  37.34,32.26 270 top
SENSE_IN  40.13,69.09 180 top
SENSE_OUT  43.94,30.23 180 top
SHUNT_NFET  9.4,4.83 180 top
SHUNT_RES_NEG  3.3,11.18 0 top
SHUNT_RES_POS  3.3,17.53 0 top
SOLAR_GND  4.06,65.79 0 top
SOLAR_IN  3.81,72.39 0 top
TG1  49.53,73.41 0 top
TG2  31.75,53.85 270 top
TG3  30.73,50.29 180 top
TG4  29.46,46.74 90 top
TG5  37.85,41.66 0 top
U1  16,49.53 180 bottom

### Tracks (layer width: path | path; a pad name or v marks a point on that pad's centre or on a via)
0  (via drill 0.35)  (2 unrouted)
  Top 0.152: C_IN5.2 29.49,48.14 TG4.2 | TG4.2 29.46,49.87 TG3.2 29.88,52.03 C13.2 29.16,52.45 27.01,54.59 27.01,58.34 27.55,58.88 | 33.05,58.2 33.11,58.25 39.14,58.25 40.32,59.44 C_C1.2 | 33.05,58.2 v32.26,57.4 | 26.83,33.51 34.52,33.51 C_OUT2_2.2 34.7,33.68 37.02,36.01 38.63,36.01 38.81,35.83 40.77,35.83 C_CSPOUT.2 40.95,35.65 40.95,32.61 41.66,31.9 43.81,31.9 44.17,31.54 44.17,29.4 43.99,29.22 43.99,28.86 44.17,28.68 44.17,23.5 | BAT_GND.1 3.42,37.08 7.89,37.08 11.82,33.15 19.15,33.15 C_OUT2.2 19.33,33.15 26.48,33.15 26.65,33.33 C_OUT1.2 26.83,33.51 | C_IN1.2 11.11,65.85 4.14,65.85 SOLAR_GND.1 | C_IN1.2 11.29,65.67 11.29,61.92 14.14,59.06 v14.22,58.93 | 27.55,58.88 28.08,59.42 28.44,59.42 R21.1 | 28.62,62.81 28.62,62.1 R23.1 28.62,62.81 | 28.62,62.81 31.48,65.67 C_IN1_3.2 31.66,65.67 33.27,64.06 34.52,64.06 | 34.52,64.06 38.09,64.06 C_IN2.2 | 27.55,58.88 24.69,61.74 24.69,62.28 24.87,62.46 | 24.87,62.46 25.23,62.81 28.62,62.81 | 24.87,62.46 24.69,62.46 21.47,65.67 C_IN1_2.2 21.29,65.85 11.29,65.85 C_IN1.2 | 22.72,43.87 23.62,44.76 26.12,44.76 29.34,47.98 TG4.2 | 22.72,43.87 20.94,42.08 20.94,37.97 v20.83,37.85 | 34.52,64.06 34.52,58.34 34.34,58.17 33.09,58.17 33.05,58.2 | 26.83,33.51 26.83,40.48 24.15,43.16 23.44,43.16 22.72,43.87 | C_IN2_2.2 38.27,74.07 41.84,74.07 C_IN3_2.1 42.02,74.07 45.42,74.07 C_IN3.1 45.6,74.25 46.85,74.25 48.1,75.5 61.5,75.5 63.29,73.71 C_IN4.2 | C_DACI.1 67.76,73.71 66.68,74.78 64.54,74.78 63.47,73.71 C_IN4.2 | C_IN4.2 63.29,73.53 62.22,72.46 62.22,70.14 58.28,66.21 R_FBIN2.1 58.28,66.03 68.83,55.49 68.83,51.73 L1.3 68.83,51.55 68.83,49.59 52.39,33.15 52.39,30.82 C_OUT3_2.2 52.39,30.65 52.39,27.25 C_OUT3.2 52.21,27.07 52.21,26.54 49.35,23.68 47.03,23.68 C_OUT4.2 46.85,23.5 44.17,23.5
  Top 0.152: 44.17,23.5 40.67,23.5 ARDUINO_NANO1.14
  Bottom 0.152: v20.83,37.85 17.75,40.92 U1.55 17.66,44.22 17.66,44.6 16.02,46.24 | U1.21 13.25,57.96 v14.22,58.93 14.32,59.06 14.32,66.39 | 16,48.77 16,46.26 16.02,46.24 | 16,48.77 U1.PAD | U1.59 15.75,45.72 | 15.75,45.72 15.75,45.98 16.02,46.24 | U1.62 14.34,44.22 14.34,44.6 14.51,44.77 14.8,44.77 15.75,45.72 | U1.9 15.99,48.78 16,48.77 | C7.1 55.07,44.94 55.07,42.8 C_DACO.1 54.89,42.62 54.89,33.51 48.99,27.61 40.41,27.61 R4.2 40.24,27.61 39.52,27.61 33.8,33.33 26.83,33.33 C_OUT1.2 | 57.03,55.13 57.21,55.31 C11.1 57.03,55.13 | 57.03,55.13 56.14,54.23 56.14,51.91 57.21,50.84 C2.1 | 57.03,55.13 54.89,57.27 32.37,57.27 v32.26,57.4 | 14.32,66.39 15.04,66.39 15.57,65.85 R18.1 | 14.32,66.39 8.78,66.39 C8.1 8.61,66.56 6.64,68.53 6.64,71.21 7.71,72.28 7.71,73 C6.1 | 39.16,8.31 38.63,8.31 R_IMON_OUT.1 39.16,8.31 | 39.16,8.31 41.13,8.31 C_IMON_OUT.1 41.31,8.31 49.35,8.31 50.96,9.92 C1.1 51.14,9.92 51.14,10.45 53.28,12.6 R5.2 53.46,12.78 54.53,13.85 | 39.16,8.31 39.16,5.13 ARDUINO_NANO1.19 | C3.1 60.07,12.6 57.93,12.6 C4.1 57.75,12.6 56.5,13.85 54.53,13.85 | 19.33,15.1 19.33,12.06 15.4,8.13 CURRENT_SENSE.1 15.22,8.13 12.72,8.13 11.46,9.38 C_IMON_IN.1 11.29,9.56 9.32,9.56 R_IMON_IN.1 9.14,9.56 | 19.33,15.1 19.33,16.35 R_DSA.1 | 9.14,9.56 7.53,11.17 7.53,17.24 C5.1 | 9.14,9.56 4.5,4.91 SHUNT_NFET.3 | 41.49,21.35 41.49,23.5 40.41,24.57 R_FBOUT2.2 | 41.49,21.35 40.24,20.1 38.04,20.1 ARDUINO_NANO1.14 31.74,16.79 30.05,15.1 19.33,15.1 | 54.53,13.85 54.53,14.92 50.24,19.21 50.24,19.57 48.46,21.35 41.49,21.35
  pour Bottom: -0.76,77.98 -0.76,-3.81 -0.51,-4.06 74.17,-4.06 74.17,78.74 0,78.74
  pour Top: 0.25,34.04 6.6,34.04 8.64,32 43.69,32 43.69,40.13 44.7,41.15 42.42,43.43 34.8,43.43 33.02,45.21 31.5,46.74 31.5,57.4 32,57.91 40.64,57.91 40.64,64.77 40.13,65.28 35.05,65.28 31.75,68.58 0,68.58 -0.25,68.33 -0.25,34.54
  pour Top: 52.58,76.96 52.58,25.4 52.32,25.15 52.32,24.64 9.91,24.64 6.35,21.08 6.35,9.91 7.87,8.38 7.87,7.11 8.38,6.6 8.38,3.56 7.87,3.05 6.1,3.05 5.59,3.56 5.59,5.08 5.33,5.33 4.32,6.35 1.27,6.35 1.27,0.76 71.88,0.76 71.88,77.22 52.83,77.22
5V
  Bottom 0.152: ARDUINO_NANO1.12 38.51,19.03 37.91,19.03 33.98,15.1 30.59,15.1 22.72,7.24 19.15,7.24 15.4,3.48 15.4,3.13 CURRENT_SENSE.3
ANALOG_IN
  Top 0.152: ARDUINO_NANO1.4 60.17,19.03 58.28,19.03 50.68,11.42 18.87,11.42 16.47,9.02 16.47,6.7 15.4,5.63 CURRENT_SENSE.2
AV_DD___V_DD___LDO33  (via drill 0.35)
  Top 0.152: 20.76,12.95 22.01,12.95 R8.2 | 20.76,12.95 19.69,12.95 R7.2 | 20.76,12.95 v20.76,17.78 19.69,17.78 v12.54,24.93 | v16.26,37.85 16.11,37.97 15.57,37.97 12.72,40.83 8.78,40.83 v8.64,40.89 8.61,41.01 8.61,44.05 7.53,45.12 7.53,52.09 6.46,53.16 6.46,53.7 v6.35,53.85
  Bottom 0.152: C4.2 57.91,9.91 | 57.91,9.91 57.91,10.31 R6.1 | 57.91,9.91 58.04,9.78 C3.2 62.46,9.78 R10.2 62.57,9.92 62.57,10.45 63.82,11.7 63.82,13.49 59.36,17.96 54,17.96 52.92,19.03 52.92,19.39 46.49,25.82 39.34,25.82 38.63,25.11 38.63,21.35 38.27,21 29.51,21 29.34,21.18 28.26,21.18 26.12,19.03 26.12,18.32 25.58,17.78 v20.76,17.78 19.51,19.03 R9.2 19.41,19 | U1.58 16.25,37.6 16.26,37.59 v16.26,37.85 16.29,37.62 16.29,33.68 12.54,29.93 v12.54,24.93 | v8.64,40.89 11.25,43.51 11.25,45.32 12.12,46.19 13.06,46.19 U1.4 | v6.35,53.85 8.92,51.28 U1.14
BG1  (via drill 0.35)
  Top 0.152: v43.94,50.8 37.09,50.8 M2.4 35.59,52.63 36.12,52.63 36.48,52.98 36.48,53.34 36.3,53.52 36.3,53.88 36.48,54.06 v36.48,56.2
  Bottom 0.152: U1.23 14.16,55.02 14.16,55.84 17.5,59.18 v20.83,59.18 20.94,59.24 22.01,60.31 27.55,60.31 31.66,56.2 v36.48,56.2
BG2  (via drill 0.35)
  Top 0.152: TG5.2 v41.15,41.66 | v25.94,49.05 25.94,49.59 26.3,49.95 26.3,55.49 24.69,57.09 24.69,58.34 23.97,59.06 v23.88,59.18
  Bottom 0.152: U1.25 15.25,55.64 17.27,57.66 22.35,57.66 v23.88,59.18 | v25.94,49.05 34.16,49.05 41.13,42.08 41.13,41.73 v41.15,41.66
BOOST1  (via drill 0.35)
  Bottom 0.152: U1.33 19.63,54.28 v23.88,50.04 23.97,49.95 26.12,49.95 26.48,49.59 58.28,49.59 58.46,49.77 58.46,49.95 58.82,50.3 59.89,50.3 62.22,52.63 62.22,54.23 | 62.22,54.23 62.75,54.23 D3.1 | 62.22,54.23 59.89,56.56 C_IN7.2
BOOST2  (via drill 0.35)
  Top 0.152: v24.33,61.03 24.33,59.77 v24.87,59.24
  Bottom 0.152: U1.27 16.25,55.95 17.46,57.15 23.37,57.15 v23.88,57.66 23.97,57.81 24.87,58.7 v24.87,59.24 | C_IN6.2 59.89,49.05 62.39,51.55 62.75,51.55 D4.1 62.93,51.73 62.93,52.63 63.82,53.52 63.82,57.63 60.07,61.38 25.76,61.38 25.4,61.03 v24.33,61.03
CA  (via drill 0.35)
  Top 0.152: v60.43,14.74 60.43,25.46 v53.1,32.79 | v25.76,35.29 11.29,35.29 8.78,37.8 v8.64,37.85
  Bottom 0.152: U1.2 13.06,45.19 12.13,45.19 11.96,45.02 11.96,41.17 v8.64,37.85 | v60.43,14.74 62.39,12.78 R10.1 | v53.1,32.79 34.88,32.79 32.37,35.29 v25.76,35.29
CLKDET  (via drill 0.35)
  Bottom 0.152: U1.56 17.25,39.9 v19.3,37.85 19.15,37.8 18.61,37.26 18.61,29.93 11.11,22.43 11.11,17.42 R12.1 10.93,17.42 9.32,17.42 C5.2
CLKOUT  (via drill 0.35)
  Top 0.152: v7.71,23.5 v11.82,19.39
  Bottom 0.152: U1.20 12.6,58.83 v12.7,58.93 12.54,59.06 12,59.6 7.71,59.6 3.25,55.13 3.25,41.73 7.71,37.26 v7.71,23.5 | v11.82,19.39 13.79,17.42 R12.2
CSN  (via drill 0.35)
  Top 0.152: TG4.1 29.49,45.34 C_IN5.1 32.51,44.32 v32.51,43.43 | v5.21,58.17 5.21,51.91 6.28,50.84 v6.35,50.8
  Bottom 0.152: v6.35,50.8 6.87,50.28 U1.12 | v5.21,58.17 5.21,72.46 7,74.25 49.71,74.25 64.9,59.06 64.9,48.52 62.75,46.37 51.31,46.37 44.88,39.94 41.31,39.94 37.91,43.33 32.55,43.33 v32.51,43.43
CSNIN  (via drill 0.35)
  Top 0.152: R_S1.2 41.02,63.22 C_S1.2 42.29,60.71 v42.67,60.71 | v51.14,45.12 v51.14,57.99
  Bottom 0.152: U1.44 19.1,48.69 19.87,48.69 23.1,45.47 v23.88,45.47 23.97,45.3 35.05,34.22 40.24,34.22 v51.14,45.12 | v51.14,57.99 50.42,57.99 47.74,60.67 42.74,60.67 v42.67,60.71
CSNOUT  (via drill 0.35)
  Top 0.152: R_S2.1 37.49,33.53 C_S2.2 38.35,34.67 v38.35,35.31
  Bottom 0.152: U1.41 22.11,50.28 v23.88,48.51 23.97,48.34 25.05,47.27 26.48,47.27 38.27,35.47 v38.35,35.31
CSP  (via drill 0.35)
  Top 0.152: TG2.1 29.49,55.27 C13.1 v29.46,56.9 | v25.23,50.66 25.23,50.3 24.15,49.23 23.62,49.23 18.61,44.23 18.61,37.62 18.08,37.08 17.54,37.08 17.01,37.62 17.01,38.15 v8.25,46.91
  Bottom 0.152: U1.13 7.89,50.78 v6.35,52.32 6.28,52.27 5.57,51.55 5.57,46.01 6.1,45.48 6.82,45.48 v8.25,46.91 | v25.23,50.66 27.01,50.66 29.34,52.98 29.34,56.74 v29.46,56.9
CSPIN___V_IN  (via drill 0.35)
  Top 0.152: C_C1.1 38.1,59.44 | 38.1,59.44 R20.2 | 38.1,61.98 C_S1.1 38.1,61.85 38.1,59.44 | 38.1,61.98 R22.2 | C_IN2.1 38.1,66.46 39.65,64.91 | 38.1,61.98 39.31,63.19 39.63,63.19 39.79,63.36 39.79,64.77 39.65,64.91 | C_IN4.1 58.57,73.66 R_FBIN1.2 | R_FBIN1.2 58.17,74.79 | 2.51,71.09 SOLAR_IN.1 | R_FBIN1.2 57.56,74.68 | 49.35,62.1 50.78,63.53 50.78,66.03 58.46,73.71 R_FBIN1.2 | 49.35,62.1 48.46,62.1 48.28,62.28 48.28,63.35 48.63,63.71 48.63,64.06 48.46,64.24 43.99,64.24 42.92,65.31 40.06,65.31 39.65,64.91 | 49.35,62.1 50.42,61.03 50.42,40.12 49.53,39.22 49.71,39.05 49.35,38.69 45.6,38.69 45.42,38.87 36.12,38.87 31.12,43.87 23.97,43.87 v23.88,43.94
  Top 1.27: SENSE_IN.2 35.88,72.49 C_IN1_3.1 C_IN1_2.1 C_IN1.1 3.91,72.49 SOLAR_IN.1
  Bottom 0.152: U1.45 U1.46 19.6,47.19 19.87,47.19 23.12,43.94 v23.88,43.94
  pour Top: 2.29,69.34 32.51,69.34 36.07,65.79 39.62,65.79 39.62,72.39 36.58,72.39 33.53,75.44 2.29,75.44
EXTV_CC___CSPOUT  (via drill 0.35)
  Top 0.152: M4.5 44.44,33.53 C_S2.1 42.47,33.7 C_CSPOUT.1 42.42,35.86 v42.42,37.34
  Top 1.27: C_OUT4.1 46.99,33.54 M4.7
  Bottom 0.152: U1.40 19.31,50.69 18.93,50.69 18.77,50.52 18.77,50.04 U1.42 19.6,49.19 21.66,49.19 23.86,46.99 v23.88,46.99 23.97,46.91 25.76,46.91 38.09,34.58 39.7,34.58 42.38,37.26 v42.42,37.34
  pour Top: 49.78,38.35 50.8,37.34 50.8,25.65 50.55,25.4 44.7,25.4 44.45,25.65 44.45,38.35
FBIN___FBIR  (via drill 0.35)
  Top 0.152: R_DACI2.1 60.2,71.22 R_FBIN1.1 R_FBIN2.2 58.11,68.89 v52.39,63.17 | v22.37,63.17 21.29,63.17 20.22,62.1 20.22,61.38 16.29,57.45 6.82,57.45 6.64,57.63 6.1,57.63 5.57,57.09 5.57,56.2 6.28,55.49 v6.35,55.37
  Bottom 0.152: U1.1 12.6,40.29 v10.16,37.85 10.04,37.8 9.68,37.8 8.96,37.08 8.43,37.08 3.6,41.9 3.6,52.63 6.28,55.31 v6.35,55.37 9.94,51.78 U1.15 | v22.37,63.17 v52.39,63.17
FBIW  (via drill 0.35)
  Top 0.152: v64.72,72.1 65.43,72.82 65.43,73.53 R_DACI1.2 | v2.53,42.8 5.92,42.8 6.28,43.16 v6.35,43.18
  Bottom 0.152: v6.35,43.18 8.1,43.18 12.2,47.28 U1.6 | v64.72,72.1 52.39,72.1 49.88,74.61 6.82,74.61 2.53,70.32 v2.53,42.8
FBOR___FBOUT  (via drill 0.35)
  Top 0.152: v17.78,37.85 17.72,37.97 17.72,39.94 7.89,49.77 7.89,55.31 6.46,56.74 v6.35,56.9 | v17.9,36.01 v23.97,36.01
  Bottom 0.152: U1.57 16.75,39.05 17.87,37.93 v17.78,37.85 17.9,37.8 v17.9,36.01 | U1.16 10.96,52.28 v6.35,56.9 | R_FBOUT1.1 37.38,22.43 37.38,24.57 R_FBOUT2.1 37.38,24.75 35.23,24.75 R_DACO2.1 35.05,24.57 34.52,24.57 33.27,23.32 31.48,23.32 27.73,27.07 27.73,29.75 23.97,33.51 v23.97,36.01
FBOW  (via drill 0.35)
  Top 0.152: v15.93,68.71 2.71,68.71 1.1,67.1 1.1,49.95 v4.32,46.73
  Bottom 0.152: 57.66,47.4 R_DACO1.2 57.75,47.8 60.79,47.8 61.5,48.52 61.5,50.12 62.04,50.66 63.47,50.66 64.18,51.38 64.18,57.81 53.28,68.71 v15.93,68.71 | U1.5 13.06,46.69 12.11,46.69 7.08,41.66 v6.35,41.66 6.28,41.73 4.32,43.69 v4.32,46.73
GATEV_CC___INTV_CC  (via drill 0.35)
  Top 0.152: v11.29,47.44 11.29,48.16 22.19,59.06 v22.35,59.18
  Bottom 0.152: C11.2 54.61,55.5 | U1.7 13.06,47.69 11.29,47.69 | v6.35,44.7 7.09,44.7 10.07,47.69 11.29,47.69 | U1.24 14.75,55.69 17.23,58.17 21.34,58.17 v22.35,59.18 22.37,59.24 23.08,59.95 27.37,59.95 31.84,55.49 54.35,55.49 C11.2 | C2.2 54.53,50.84 54.53,52.98 R24.2 54.53,53.16 54.53,55.31 C11.2 | v11.29,47.44 11.29,47.69
GATEVCC'
  Bottom 0.152: 59.71,53.16 59.71,54.06 D3.2 | 59.71,53.16 59.71,51.73 D4.2 | 59.71,53.16 57.39,53.16 R24.1
IMON_IN___IIR  (via drill 0.35)
  Top 0.152: v22.54,32.08 8.29,32.08 6.15,34.22 1.81,34.22 1.64,34.4 1.64,42.98 6.28,47.62 v6.35,47.75
  Bottom 0.152: U1.53 18.75,42.97 23.59,38.13 | 23.59,38.13 v23.88,37.85 | U1.10 13.06,49.19 7.81,49.19 6.38,47.75 v6.35,47.75 | R_IMON_IN.2 9.32,12.42 11.29,12.42 C_IMON_IN.2 11.46,12.42 18.26,19.21 18.26,21.89 22.54,26.18 v22.54,32.08 22.54,37.08 23.59,38.13 | 23.62,38.15 23.59,38.13
IMON_OUT  (via drill 0.35)
  Top 0.152: v1.81,56.38 4.67,59.24 7.36,59.24 7.53,59.06 8.07,59.06 v8.13,58.93
  Bottom 0.152: U1.17 11.48,52.78 8.13,56.13 v8.13,58.93 | 38.63,11.17 41.13,11.17 C_IMON_OUT.2 | 38.63,11.17 38.63,13.31 R_IOW.1 | 38.63,11.17 R_IMON_OUT.2 38.45,10.99 36.12,10.99 R_IOR.1 35.95,10.99 33.27,10.99 23.44,1.16 5.03,1.16 1.81,4.38 v1.81,56.38
IOR  (via drill 0.35)
  Top 0.152: v31.84,14.03 31.12,14.03 v20.22,24.93 | v19.33,36.72 12.89,36.72 11.82,37.8 v11.68,37.85
  Bottom 0.152: v11.68,37.85 11.79,37.85 13.25,39.3 U1.64 | v31.84,14.03 35.95,14.03 R_IOR.2 | v20.22,24.93 20.22,35.83 v19.33,36.72
IOW  (via drill 0.35)
  Top 0.152: v38.27,16.71 35.05,16.71 32.55,19.21 32.55,25.46 v31.84,26.18
  Bottom 0.152: U1.50 18.95,45.69 19.88,45.69 20.4,45.17 20.4,44.37 v23.88,40.89 23.97,40.83 24.69,40.12 24.69,33.33 v31.84,26.18 | v38.27,16.71 41.49,13.49 R_IOW.2
N$1
  Top 1.27: M1.9 44.32,69.09 SENSE_IN.1
  pour Top: 40.39,66.04 40.39,71.88 49.78,71.88 49.78,64.52 44.45,64.52 44.45,64.77 43.18,66.04
N$2
  Top 0.152: TG2.2 31.58,52.26 TG3.1 33.23,48.64 M3.1
  Top 1.27: M3.2 33.78,49.03 33.78,54.1 34.67,54.99 M2.2
  pour Top: 36.07,45.47 33.78,45.47 33.02,46.23 33.02,56.13 33.78,56.9 36.07,56.9 36.07,53.09 34.54,53.09 34.54,51.31 35.05,50.8 36.07,50.8
N$3
  Top 0.152: TG1.1 49.12,72.39 49.78,72.39 50.29,71.88 50.29,64.27 M1.4
N$4
  Top 0.152: R_DACI2.2 63.55,70.71 R_DACI1.1 67.8,70.71 C_DACI.2
N$5
  Top 0.152: M3.4 35.44,43.05 36.42,42.06 TG5.1
N$6
  Top 1.27: R_BAT.2 3.81,30.23 BAT_RES_PAD.1
  pour Top: 1.52,27.69 7.37,27.69 8.13,28.45 8.13,31.5 6.1,33.53 1.52,33.53
N$7  (1 unrouted)
  Top 0.152: IC1.3 30.25,20.56 32.27,18.54 ARDUINO_NANO1.15
N$8
  Top 1.27: SHUNT_RES_NEG.1 6.86,7.61 SHUNT_NFET.2
  pour Top: 1.52,13.97 5.08,13.97 5.59,13.46 5.59,7.87 7.87,5.59 7.87,3.56 5.84,3.56 5.84,5.59 5.59,5.84 3.3,8.13 1.52,8.13
N$9
  Top 0.152: ARDUINO_NANO1.21 46.92,3.66 42.92,3.66 40.95,1.7 12.54,1.7 9.5,4.73 SHUNT_NFET.1
N$23
  Bottom 0.152: R_DACO1.1 57.66,42.8 C_DACO.2 57.75,42.62 57.75,35.83 48.1,26.18 34.52,26.18 33.09,24.75 32.37,24.75 R_DACO2.2
N$28
  Bottom 0.152: R_DSA.2 24.74,16.51 D_S.C
N$32
  Bottom 0.152: C7.2 55.25,47.8 55.6,47.8 56.68,46.73 62.57,46.73 64.54,48.7 64.54,57.99 51.85,70.68 12.89,70.68 10.57,73 R13.1
RT  (via drill 0.35)
  Bottom 0.152: U1.22 13.75,56.96 15.72,58.93 v15.75,58.93 15.75,59.06 15.75,62.81 R18.2
SCL  (via drill 0.35)
  Top 0.152: R7.1 I2C_COMM.1 19.51,5.27 18.61,4.38 14.86,4.38 13.97,5.27 13.97,9.02 16.47,11.53 | 16.47,11.53 38.09,11.53 45.6,19.03 47.79,19.03 ARDUINO_NANO1.9 | v9.5,22.78 16.47,15.81 16.47,11.53
  Bottom 0.152: U1.63 13.75,38.39 v13.21,37.85 13.07,37.8 13.07,31.54 9.5,27.97 v9.5,22.78
SDA  (via drill 0.35)
  Top 0.152: R8.1 I2C_COMM.2
  Bottom 0.152: U1.61 14.75,37.87 v14.73,37.85 14.68,37.8 14.68,32.61 10.21,28.14 10.21,21.53 2.89,14.21 2.89,4.38 5.39,1.88 18.61,1.88 22.01,5.27 I2C_COMM.2 22.19,5.45 31.48,14.74 34.16,14.74 36.84,17.42 46.49,17.42 48.1,19.03 49.34,19.03 ARDUINO_NANO1.8
SHDN  (via drill 0.35)
  Top 0.152: R22.1 R23.2 29.92,60.5 29.72,60.71 26.67,60.71 v25.4,61.98 | v19.51,61.74 15.57,57.81 8.25,57.81 7.18,58.88 4.85,58.88 4.5,58.52 4.5,51.55 6.28,49.77 6.28,49.41 v6.35,49.28
  Bottom 0.152: U1.11 6.8,49.78 6.35,49.33 v6.35,49.28 | v19.51,61.74 25.05,61.74 25.23,61.92 v25.4,61.98
SS  (via drill 0.35)
  Top 0.152: v8.78,61.38 11.11,59.06 v11.18,58.93
  Bottom 0.152: U1.19 12,53.78 11.18,54.61 v11.18,58.93 | v8.78,61.38 8.78,63.53 C8.2
STATUS  (via drill 0.35)
  Top 0.152: v23.26,36.72 23.26,37.44 23.08,37.62 23.08,38.51 23.8,39.22 v23.88,39.37
  Bottom 0.152: R9.1 23.26,19.05 | 23.26,19.05 24.74,19.05 D_S.A | U1.51 18.95,45.19 19.87,45.19 20.04,45.02 20.04,43.21 v23.88,39.37 | v23.26,36.72 23.26,19.05 | 23.26,19.03 23.26,19.05
SW1  (via drill 0.35)
  Top 0.152: v49.53,59.95 v49.52,59.95 | v27.73,54.95 28.26,54.41 28.26,54.23 28.62,53.88 v32.55,53.88 | 37.38,51.82 v37.38,51.55
  Top 1.27: M1.2 46.35,57.14 L1.1 45.21,54.99 M2.7
  Bottom 0.152: U1.31 18.25,55.69 21.27,55.69 v23.88,53.09 23.97,53.16 25.94,53.16 v27.73,54.95 | v49.53,59.95 58.64,59.95 61.86,56.74 62.57,56.74 C_IN7.1 | v32.55,53.88 35.05,53.88 v37.38,51.55
  pour Top: 48.26,63.75 48.26,61.21 50.04,59.44 50.04,53.59 48.26,51.82 36.58,51.82 36.58,56.9 41.15,56.9 44.45,60.2 44.45,63.75
SW2  (via drill 0.35)  (1 unrouted)
  Top 0.152: v61.5,47.44 58.28,47.44 50.06,39.22 50.04,39.22 | v25.23,48.34 25.23,49.41 25.94,50.12 25.94,52.09 23.97,54.06 23.97,54.59 v23.88,54.61 | 36.66,45.66 v36.48,45.66
  Top 1.27: M3.9 46.61,46.74 | 46.61,46.74 L1.2 | M4.2 46.61,41.02 46.61,46.74
  Bottom 0.152: U1.29 17.25,55.44 18.01,56.2 22.29,56.2 v23.88,54.61 | v61.5,47.44 62.57,48.52 62.57,48.87 C_IN6.1 | v25.23,48.34 33.8,48.34 v36.48,45.66
  pour Top: 45.72,39.12 45.72,41.4 43.18,43.94 36.58,43.94 36.58,49.02 37.08,49.53 50.04,49.53 50.04,39.12
SWEN___SWENO  (via drill 0.35)
  Top 0.152: v6.35,46.23 6.46,46.19 6.46,45.66 7.89,44.23 7.89,37.62 10.93,34.58 26.12,34.58 26.48,34.93 26.48,39.76 23.97,42.26 v23.88,42.42
  Bottom 0.152: U1.8 13.06,48.19 8.29,48.19 6.35,46.25 v6.35,46.23 | U1.49 18.95,46.19 19.89,46.19 23.65,42.42 v23.88,42.42 23.97,42.26 25.05,41.19 25.05,33.68 31.12,27.61 37.38,27.61 R4.1
TEMPSENSE  (via drill 0.35)
  Top 0.152: v10.93,36.72 10.93,38.15 9.86,39.22 8.78,39.22 v8.64,39.37
  Bottom 0.152: 53.34,10.29 R5.1 | R6.2 R5.1 | v8.64,39.37 11.61,42.34 11.61,45.17 12.12,45.69 13.06,45.69 U1.3 | 43.45,11.17 41.66,9.38 37.55,9.38 37.38,9.2 37.38,4.38 38.09,3.66 38.09,3.48 38.81,2.77 44.52,2.77 45.77,4.02 45.77,4.2 50.24,8.67 52.21,8.67 53.28,9.74 R5.1 | 43.45,11.17 44.7,12.42 50.96,12.42 C1.2 | v10.93,36.72 10.93,29.93 8.43,27.43 8.43,20.28 2.53,14.38 2.53,4.2 5.21,1.52 23.26,1.52 34.52,12.78 37.2,12.78 37.55,13.13 37.55,14.56 37.73,14.74 39.7,14.74 40.41,14.03 40.41,12.42 40.59,12.24 42.38,12.24 43.45,11.17
TG1  (via drill 0.35)
  Top 0.152: TG1.2 51.56,72.8 v51.56,71.37 51.49,71.21 51.49,68.53 v50.96,68 | v21.65,62.46 21.65,60.85 23.08,59.42 23.08,52.45 23.8,51.73 v23.88,51.56
  Bottom 0.152: U1.32 20.51,54.93 v23.88,51.56 | v50.96,68 26.12,68 21.65,63.53 v21.65,62.46
TG2  (via drill 0.35)
  Top 0.152: M4.4 44.45,40.64 v42.42,40.64 | v27.91,52.63 v27.91,47.62
  Bottom 0.152: U1.28 16.75,55.69 17.7,56.64 23.37,56.64 v23.88,56.13 23.97,56.02 24.15,55.84 27.91,55.84 28.44,55.31 28.44,54.59 27.91,54.06 v27.91,52.63 | v27.91,47.62 30.59,44.94 36.84,44.94 41.13,40.65 42.38,40.65 v42.42,40.64
V_BAT  (3 unrouted)
  pour Top: 43.69,31.5 43.69,25.4 8.89,25.4 4.57,21.08 1.52,21.08 1.52,27.18 7.62,27.18 8.64,28.19 8.64,31.24 8.89,31.5
  pour Top: 1.52,21.08 1.52,14.48 5.08,14.48 5.08,21.59 2.03,21.59
V_C  (via drill 0.35)
  Top 0.152: v17.01,61.2 15.04,59.24 15.04,58.7 14.5,58.17 10.39,58.17 9.68,58.88 v9.65,58.93
  Bottom 0.152: R13.2 10.1,69.89 | U1.18 12.51,53.37 11.88,53.37 9.65,55.6 v9.65,58.93 | C6.2 7.89,70.32 10.39,70.32 R13.2 | v17.01,61.2 17.01,66.56 13.43,70.14 10.57,70.14 R13.2
VINR  (via drill 0.35)
  Top 0.152: R20.1 R21.2 29.87,57.91 v27.69,57.91 | v26.3,56.56 26.3,56.02 26.65,55.66 26.65,48.7 24.15,46.19 23.62,46.19 20.04,42.62 20.04,37.62 20.58,37.08 21.47,37.08 22.19,37.8 v22.35,37.85
  Bottom 0.152: U1.54 18.25,41.95 v22.35,37.85 | v26.3,56.56 27.55,57.81 v27.69,57.91

### Text on the board
bNames: Senior Design MPPT Circuit / Spring 2021 / Brandon H.
Reference: MRE Senior Design / Spring 2021 / Brandon H. / Model 1.0 | <-- SHUNT / --> BATTERY